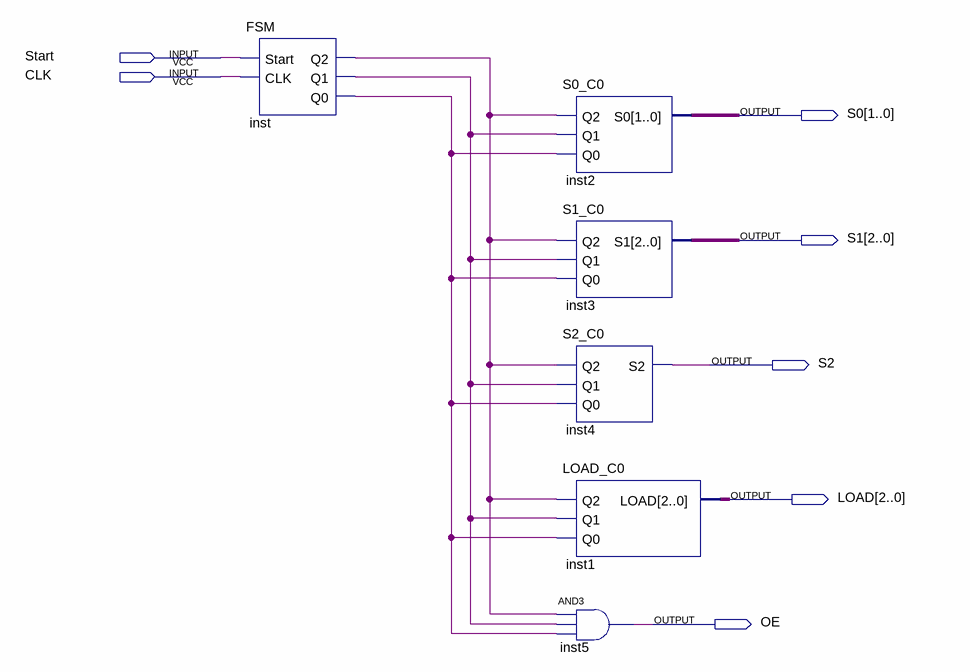
[diagram p0: schematic sheet]
// Quartus schematic Controller0.bdf as structural Verilog: 6 symbols, 7 pins
module Controller0 (
  input  Start,
  input  CLK,
  output [1:0] S0,
  output [2:0] S1,
  output S2,
  output [2:0] LOAD,
  output OE
);

  wire inst_q0, inst_q1, inst_q2;

  FSM inst (.Start(Start), .CLK(CLK), .Q2(inst_q2), .Q1(inst_q1), .Q0(inst_q0));
  S0_C0 inst2 (.Q2(inst_q2), .Q1(inst_q1), .Q0(inst_q0), .S0(S0));
  S1_C0 inst3 (.Q2(inst_q2), .Q1(inst_q1), .Q0(inst_q0), .S1(S1));
  S2_C0 inst4 (.Q2(inst_q2), .Q1(inst_q1), .Q0(inst_q0), .S2(S2));
  LOAD_C0 inst1 (.Q2(inst_q2), .Q1(inst_q1), .Q0(inst_q0), .LOAD(LOAD));
  and inst5 (OE, inst_q2, inst_q1, inst_q0);
endmodule
